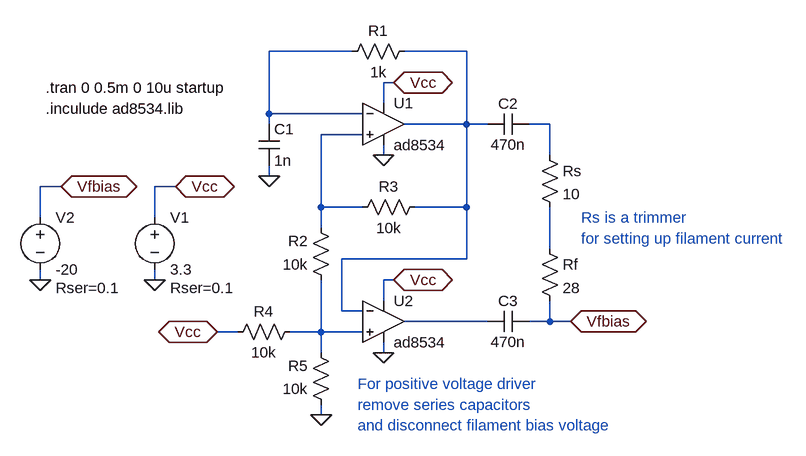
[diagram p0: schematic ad8534-filament.asc]
ad8534-filament.asc, the LTspice schematic file:
Version 4
SHEET 1 1548 852
WIRE 192 96 64 96
WIRE 368 96 272 96
WIRE 256 144 240 144
WIRE 240 176 240 144
WIRE 64 192 64 96
WIRE 208 192 64 192
WIRE 64 208 64 192
WIRE 368 208 368 96
WIRE 368 208 272 208
WIRE 400 208 368 208
WIRE 496 208 464 208
WIRE 208 224 144 224
WIRE 240 256 240 240
WIRE 496 256 496 208
WIRE 64 288 64 272
WIRE -256 304 -288 304
WIRE -80 304 -112 304
WIRE 144 336 144 224
WIRE 208 336 144 336
WIRE 368 336 368 208
WIRE 368 336 288 336
WIRE -288 352 -288 304
WIRE -112 352 -112 304
WIRE 144 368 144 336
WIRE 496 400 496 336
WIRE 368 416 368 336
WIRE 368 416 176 416
WIRE -288 448 -288 432
WIRE -112 448 -112 432
WIRE 256 448 240 448
WIRE 240 480 240 448
WIRE 176 496 176 416
WIRE 208 496 176 496
WIRE 400 512 272 512
WIRE 496 512 496 480
WIRE 496 512 464 512
WIRE 528 512 496 512
WIRE 16 528 -16 528
WIRE 144 528 144 448
WIRE 144 528 96 528
WIRE 208 528 144 528
WIRE 144 560 144 528
WIRE 240 560 240 544
WIRE 144 656 144 640
FLAG -112 448 0
FLAG -80 304 Vcc
IOPIN -80 304 BiDir
FLAG 240 256 0
FLAG 256 144 Vcc
IOPIN 256 144 BiDir
FLAG 64 288 0
FLAG 240 560 0
FLAG 256 448 Vcc
IOPIN 256 448 BiDir
FLAG -16 528 Vcc
IOPIN -16 528 BiDir
FLAG 144 656 0
FLAG -288 448 0
FLAG -256 304 Vfbias
IOPIN -256 304 BiDir
FLAG 528 512 Vfbias
IOPIN 528 512 BiDir
SYMBOL Opamps\\opamp2 240 144 R0
SYMATTR InstName U1
SYMATTR Value ad8534
SYMBOL voltage -112 336 R0
WINDOW 123 0 0 Left 0
WINDOW 39 24 124 Left 2
SYMATTR SpiceLine Rser=0.1
SYMATTR InstName V1
SYMATTR Value 3.3
SYMBOL cap 48 208 R0
SYMATTR InstName C1
SYMATTR Value 1n
SYMBOL res 288 80 R90
WINDOW 0 0 56 VBottom 2
WINDOW 3 32 56 VTop 2
SYMATTR InstName R1
SYMATTR Value 1k
SYMBOL Opamps\\opamp2 240 448 R0
SYMATTR InstName U2
SYMATTR Value ad8534
SYMBOL res 160 464 R180
WINDOW 0 36 76 Left 2
WINDOW 3 36 40 Left 2
SYMATTR InstName R2
SYMATTR Value 10k
SYMBOL res 304 320 R90
WINDOW 0 0 56 VBottom 2
WINDOW 3 32 56 VTop 2
SYMATTR InstName R3
SYMATTR Value 10k
SYMBOL res 112 512 R90
WINDOW 0 0 56 VBottom 2
WINDOW 3 32 56 VTop 2
SYMATTR InstName R4
SYMATTR Value 10k
SYMBOL res 160 656 R180
WINDOW 0 36 76 Left 2
WINDOW 3 36 40 Left 2
SYMATTR InstName R5
SYMATTR Value 10k
SYMBOL res 480 384 R0
SYMATTR InstName Rf
SYMATTR Value 28
SYMBOL cap 464 192 R90
WINDOW 0 0 32 VBottom 2
WINDOW 3 32 32 VTop 2
SYMATTR InstName C2
SYMATTR Value 470n
SYMBOL cap 464 496 R90
WINDOW 0 0 32 VBottom 2
WINDOW 3 32 32 VTop 2
SYMATTR InstName C3
SYMATTR Value 470n
SYMBOL voltage -288 336 R0
WINDOW 123 0 0 Left 0
WINDOW 39 24 124 Left 2
SYMATTR SpiceLine Rser=0.1
SYMATTR InstName V2
SYMATTR Value -20
SYMBOL res 480 240 R0
SYMATTR InstName Rs
SYMATTR Value 10
TEXT -280 184 Left 2 !.inculude ad8534.lib
TEXT -280 152 Left 2 !.tran 0 0.5m 0 10u startup
TEXT 200 608 Left 2 ;For positive voltage driver
TEXT 200 640 Left 2 ;remove series capacitors
TEXT 544 352 Left 2 ;Rs is a trimmer
TEXT 544 384 Left 2 ;for setting up filament current
TEXT 200 672 Left 2 ;and disconnect filament bias voltage

The netlist it stands for:
* ad8534-filament.asc
XU1 N004 N001 Vcc 0 N002 ad8534  ; pins In+ In- V+ V- OUT
V1 Vcc 0 3.3 Rser=0.1
C1 N001 0 1n
R1 N002 N001 1k
XU2 N007 N002 Vcc 0 N006 ad8534  ; pins In+ In- V+ V- OUT
R2 N007 N004 10k
R3 N002 N004 10k
R4 N007 Vcc 10k
R5 0 N007 10k
Rf N005 Vfbias 28
C2 N003 N002 470n
C3 Vfbias N006 470n
V2 Vfbias 0 -20 Rser=0.1
Rs N003 N005 10
.inculude ad8534.lib
.tran 0 0.5m 0 10u startup
* For positive voltage driver
* remove series capacitors
* Rs is a trimmer
* for setting up filament current
* and disconnect filament bias voltage
.backanno
.end